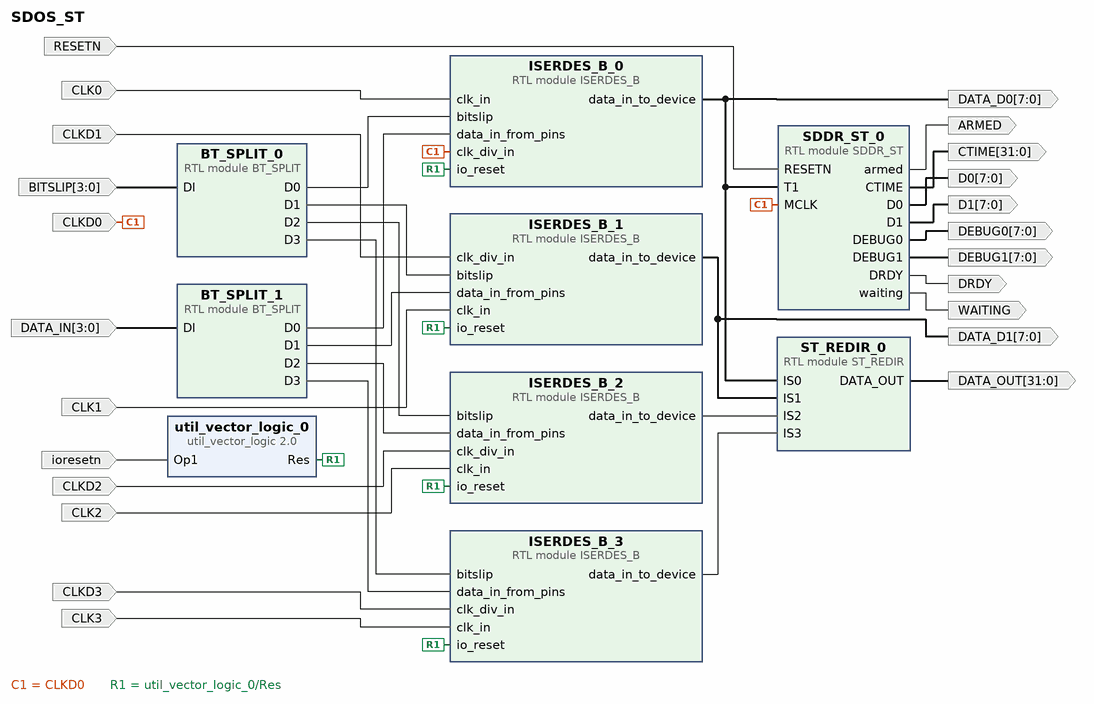
[diagram p0: block diagram of the top level]
# Vivado block design SDOS_ST, xc7z020clg400-1, Vivado 2019.1
create_bd_design SDOS_ST

create_bd_port -dir O ARMED
create_bd_port -dir I -from 3 -to 0 BITSLIP
create_bd_port -dir I -type clk CLK0
set_property -dict {CONFIG.FREQ_HZ 800000000} [get_bd_ports CLK0]
create_bd_port -dir I -type clk CLK1
set_property -dict {CONFIG.FREQ_HZ 500000000} [get_bd_ports CLK1]
create_bd_port -dir I -type clk CLK2
set_property -dict {CONFIG.FREQ_HZ 800000000} [get_bd_ports CLK2]
create_bd_port -dir I -type clk CLK3
set_property -dict {CONFIG.FREQ_HZ 500000000} [get_bd_ports CLK3]
create_bd_port -dir O -from 31 -to 0 CTIME
create_bd_port -dir O -from 7 -to 0 D0
create_bd_port -dir O -from 7 -to 0 D1
create_bd_port -dir O -from 7 -to 0 DATA_D0
create_bd_port -dir O -from 7 -to 0 DATA_D1
create_bd_port -dir O -from 31 -to 0 -type data DATA_OUT
set_property -dict {CONFIG.PortWidth 33} [get_bd_ports DATA_OUT]
create_bd_port -dir O DRDY
create_bd_port -dir I -type rst RESETN
create_bd_port -dir O WAITING
create_bd_port -dir I -type rst ioresetn
create_bd_port -dir I -from 3 -to 0 -type data DATA_IN
create_bd_port -dir O -from 7 -to 0 DEBUG0
create_bd_port -dir O -from 7 -to 0 DEBUG1
create_bd_port -dir I -type clk CLKD0
set_property -dict {CONFIG.FREQ_HZ 200000000} [get_bd_ports CLKD0]
create_bd_port -dir I -type clk CLKD1
set_property -dict {CONFIG.FREQ_HZ 200000000} [get_bd_ports CLKD1]
create_bd_port -dir I -type clk CLKD2
set_property -dict {CONFIG.FREQ_HZ 200000000} [get_bd_ports CLKD2]
create_bd_port -dir I -type clk CLKD3
set_property -dict {CONFIG.FREQ_HZ 200000000} [get_bd_ports CLKD3]

create_bd_cell -type module -reference BT_SPLIT BT_SPLIT_0
create_bd_cell -type module -reference BT_SPLIT BT_SPLIT_1
create_bd_cell -type module -reference ST_REDIR ST_REDIR_0
create_bd_cell -type ip -vlnv xilinx.com:ip:util_vector_logic:2.0 util_vector_logic_0
set_property -dict {CONFIG.C_OPERATION not CONFIG.C_SIZE 1} [get_bd_cells util_vector_logic_0]
create_bd_cell -type module -reference ISERDES_B ISERDES_B_0
create_bd_cell -type module -reference ISERDES_B ISERDES_B_1
create_bd_cell -type module -reference ISERDES_B ISERDES_B_2
create_bd_cell -type module -reference ISERDES_B ISERDES_B_3
create_bd_cell -type module -reference SDDR_ST SDDR_ST_0
set_property -dict {CONFIG.SIG_WIDTH 8} [get_bd_cells SDDR_ST_0]

# ---- connections ----

connect_bd_net [get_bd_ports BITSLIP] [get_bd_pins BT_SPLIT_0/DI]
connect_bd_net [get_bd_pins BT_SPLIT_0/D0] [get_bd_pins ISERDES_B_0/bitslip]
connect_bd_net [get_bd_pins BT_SPLIT_0/D1] [get_bd_pins ISERDES_B_1/bitslip]
connect_bd_net [get_bd_pins BT_SPLIT_0/D2] [get_bd_pins ISERDES_B_2/bitslip]
connect_bd_net [get_bd_pins BT_SPLIT_0/D3] [get_bd_pins ISERDES_B_3/bitslip]
connect_bd_net [get_bd_pins ISERDES_B_0/data_in_to_device] [get_bd_ports DATA_D0] [get_bd_pins ST_REDIR_0/IS0] [get_bd_pins SDDR_ST_0/T1]
connect_bd_net [get_bd_pins ISERDES_B_1/data_in_to_device] [get_bd_ports DATA_D1] [get_bd_pins ST_REDIR_0/IS1]
connect_bd_net [get_bd_pins ISERDES_B_2/data_in_to_device] [get_bd_pins ST_REDIR_0/IS2]
connect_bd_net [get_bd_pins ISERDES_B_3/data_in_to_device] [get_bd_pins ST_REDIR_0/IS3]
connect_bd_net [get_bd_ports RESETN] [get_bd_pins SDDR_ST_0/RESETN]
connect_bd_net [get_bd_pins SDDR_ST_0/CTIME] [get_bd_ports CTIME]
connect_bd_net [get_bd_pins SDDR_ST_0/D0] [get_bd_ports D0]
connect_bd_net [get_bd_pins SDDR_ST_0/D1] [get_bd_ports D1]
connect_bd_net [get_bd_pins SDDR_ST_0/DRDY] [get_bd_ports DRDY]
connect_bd_net [get_bd_pins SDDR_ST_0/armed] [get_bd_ports ARMED]
connect_bd_net [get_bd_pins SDDR_ST_0/waiting] [get_bd_ports WAITING]
connect_bd_net [get_bd_pins ST_REDIR_0/DATA_OUT] [get_bd_ports DATA_OUT]
connect_bd_net [get_bd_ports DATA_IN] [get_bd_pins BT_SPLIT_1/DI]
connect_bd_net [get_bd_pins BT_SPLIT_1/D0] [get_bd_pins ISERDES_B_0/data_in_from_pins]
connect_bd_net [get_bd_pins BT_SPLIT_1/D1] [get_bd_pins ISERDES_B_1/data_in_from_pins]
connect_bd_net [get_bd_pins BT_SPLIT_1/D2] [get_bd_pins ISERDES_B_2/data_in_from_pins]
connect_bd_net [get_bd_pins BT_SPLIT_1/D3] [get_bd_pins ISERDES_B_3/data_in_from_pins]
connect_bd_net [get_bd_pins SDDR_ST_0/DEBUG0] [get_bd_ports DEBUG0]
connect_bd_net [get_bd_pins SDDR_ST_0/DEBUG1] [get_bd_ports DEBUG1]
connect_bd_net -net CLK_DIV_IO_1_CLK_O [get_bd_ports CLKD1] [get_bd_pins ISERDES_B_1/clk_div_in]
connect_bd_net -net CLKD0_1 [get_bd_ports CLKD0] [get_bd_pins ISERDES_B_0/clk_div_in] [get_bd_pins SDDR_ST_0/MCLK]
connect_bd_net -net CLKD2_1 [get_bd_ports CLKD2] [get_bd_pins ISERDES_B_2/clk_div_in]
connect_bd_net -net CLKD3_1 [get_bd_ports CLKD3] [get_bd_pins ISERDES_B_3/clk_div_in]
connect_bd_net -net CLK3_1 [get_bd_ports CLK3] [get_bd_pins ISERDES_B_3/clk_in]
connect_bd_net -net CLK2_1 [get_bd_ports CLK2] [get_bd_pins ISERDES_B_2/clk_in]
connect_bd_net -net CLK1_1 [get_bd_ports CLK1] [get_bd_pins ISERDES_B_1/clk_in]
connect_bd_net -net CLK0_1 [get_bd_ports CLK0] [get_bd_pins ISERDES_B_0/clk_in]
connect_bd_net [get_bd_pins util_vector_logic_0/Res] \
  [get_bd_pins ISERDES_B_0/io_reset] [get_bd_pins ISERDES_B_1/io_reset] [get_bd_pins ISERDES_B_2/io_reset] \
  [get_bd_pins ISERDES_B_3/io_reset]
connect_bd_net [get_bd_ports ioresetn] [get_bd_pins util_vector_logic_0/Op1]

validate_bd_design
save_bd_design
